# Altium schematic sheet Buttons.SchDoc
size A; SheetNumber: 4; SheetTotal: 3
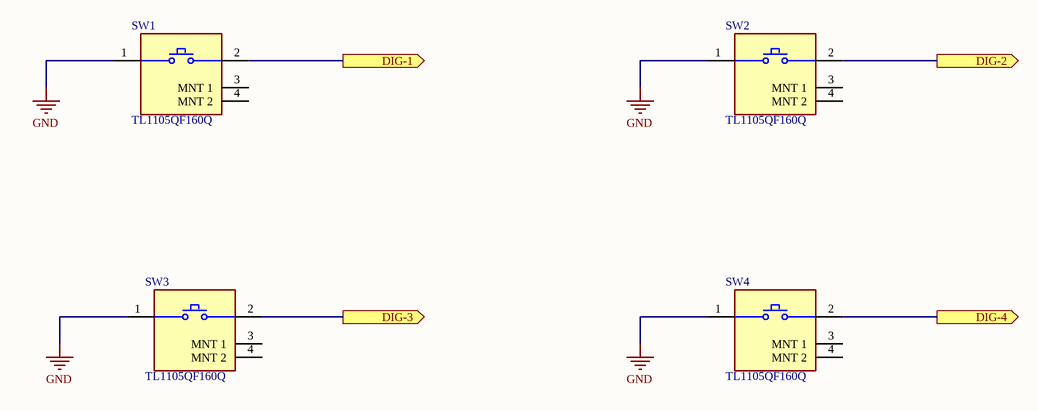
[diagram p0: Buttons.SchDoc]

## Parts
SW1  TL1105QF160Q  [FP-TL1105QF160Q-MFG]
SW2  TL1105QF160Q  [FP-TL1105QF160Q-MFG]
SW3  TL1105QF160Q  [FP-TL1105QF160Q-MFG]
SW4  TL1105QF160Q  [FP-TL1105QF160Q-MFG]

## Ports
DIG-1 (out), DIG-2 (out), DIG-3 (out), DIG-4 (out)

## Nets
GND: SW1.1 SW2.1 SW3.1 SW4.1
DIG-1: SW1.2 ; port DIG-1
DIG-2: SW2.2 ; port DIG-2
DIG-3: SW3.2 ; port DIG-3
DIG-4: SW4.2 ; port DIG-4

Not connected (* = marked no-connect by the designer): SW1 3(MNT_1) 4(MNT_2); SW2 3(MNT_1) 4(MNT_2); SW3 3(MNT_1) 4(MNT_2); SW4 3(MNT_1) 4(MNT_2)

## Library data of the parts
SW1-SW4 = CMP-17879-000001-1: SWITCH TACTILE SPST-NO 0.05A 12V; Manufacturer: E-Switch; Contact Resistance: 100mΩ; Throw Configuration: SPST; Operating Force: 160gf; Description: Tactile Switches 6mm R/A 5/8" ACTUATR; Contact Current Rating: 50mA; Electromechanical Life: 100000Cycles; ComponentLink2Description: Datasheet; Lead Free: Yes; Manufacturer Part Number: TL1105QF160Q; Package: TL1105QF160Q; Device Class L1: Electromechanical; Device Class L2: Switches; ComponentLink2URL: http://spec_sheets.e-switch.com/specs/P010022.pdf; RoHS: TRUE; Height: 7.55mm; Category: Switch; Device Class L3: Tactile Switches; Digikey Description: SWITCH TACTILE SPST-NO 0.05A 12V; Octopart: https://octopart.com/tl1105qf160q-e-switch-1057556; Automotive: No; Mouser Description: TL1105 Series SPST 1.6 N Round Button Right Angle Through Hole Tactile Switch; Mount: Through Hole; Voltage Rating Dc: 12V